# EAGLE design mother (EAGLE 8.2.2)

## Sheet 1 of 3
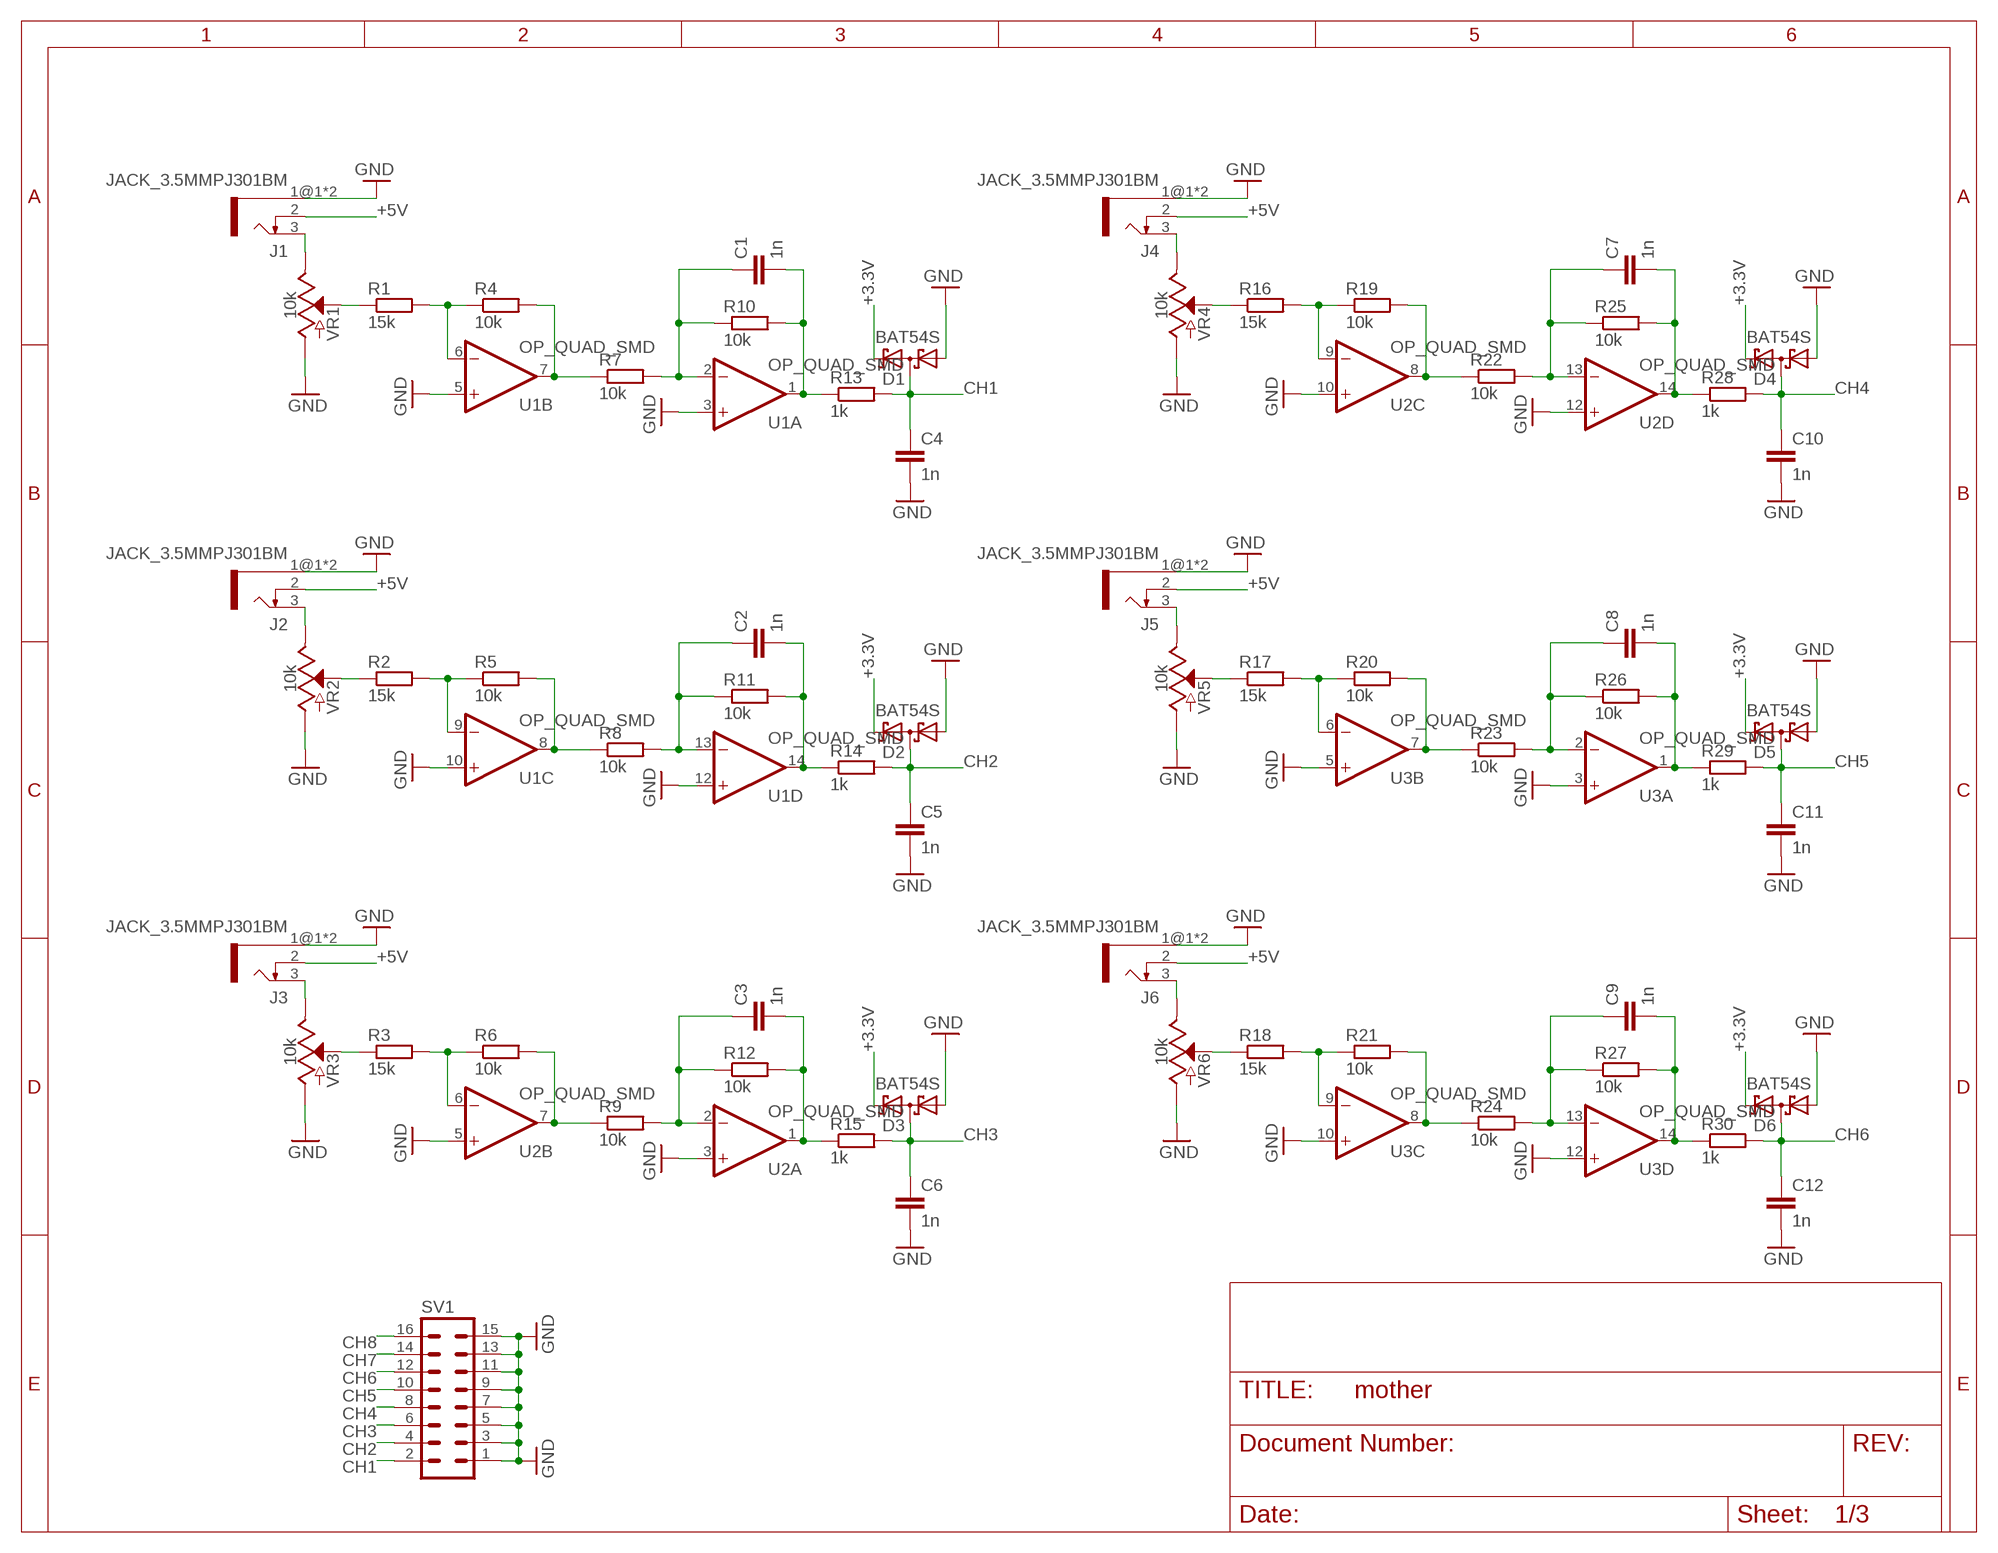
[diagram p0: schematic, sheet 1]

### Parts
C1  1n  CC0603  [C0603]
C2  1n  CC0603  [C0603]
C3  1n  CC0603  [C0603]
C4  1n  CC0603  [C0603]
C5  1n  CC0603  [C0603]
C6  1n  CC0603  [C0603]
C7  1n  CC0603  [C0603]
C8  1n  CC0603  [C0603]
C9  1n  CC0603  [C0603]
C10  1n  CC0603  [C0603]
C11  1n  CC0603  [C0603]
C12  1n  CC0603  [C0603]
D1  BAT54S  [SOT23]
D2  BAT54S  [SOT23]
D3  BAT54S  [SOT23]
D4  BAT54S  [SOT23]
D5  BAT54S  [SOT23]
D6  BAT54S  [SOT23]
J1  JACK_3.5MMPJ301BM  [PJ301BM_JACK]
J2  JACK_3.5MMPJ301BM  [PJ301BM_JACK]
J3  JACK_3.5MMPJ301BM  [PJ301BM_JACK]
J4  JACK_3.5MMPJ301BM  [PJ301BM_JACK]
J5  JACK_3.5MMPJ301BM  [PJ301BM_JACK]
J6  JACK_3.5MMPJ301BM  [PJ301BM_JACK]
R1  15k  RR0603  [R0603]
R2  15k  RR0603  [R0603]
R3  15k  RR0603  [R0603]
R4  10k  RR0603  [R0603]
R5  10k  RR0603  [R0603]
R6  10k  RR0603  [R0603]
R7  10k  RR0603  [R0603]
R8  10k  RR0603  [R0603]
R9  10k  RR0603  [R0603]
R10  10k  RR0603  [R0603]
R11  10k  RR0603  [R0603]
R12  10k  RR0603  [R0603]
R13  1k  RR0603  [R0603]
R14  1k  RR0603  [R0603]
R15  1k  RR0603  [R0603]
R16  15k  RR0603  [R0603]
R17  15k  RR0603  [R0603]
R18  15k  RR0603  [R0603]
R19  10k  RR0603  [R0603]
R20  10k  RR0603  [R0603]
R21  10k  RR0603  [R0603]
R22  10k  RR0603  [R0603]
R23  10k  RR0603  [R0603]
R24  10k  RR0603  [R0603]
R25  10k  RR0603  [R0603]
R26  10k  RR0603  [R0603]
R27  10k  RR0603  [R0603]
R28  1k  RR0603  [R0603]
R29  1k  RR0603  [R0603]
R30  1k  RR0603  [R0603]
SV1  MA08-2  [MA08-2]
U1  OP_QUAD_SMD  [SO14]
U2  OP_QUAD_SMD  [SO14]
U3  OP_QUAD_SMD  [SO14]
VR1  10k  POTENTIOMETER-PTH-9MM-1/20W-20%-KIT  [POT-PTH-ALPS-KIT]
VR2  10k  POTENTIOMETER-PTH-9MM-1/20W-20%-KIT  [POT-PTH-ALPS-KIT]
VR3  10k  POTENTIOMETER-PTH-9MM-1/20W-20%-KIT  [POT-PTH-ALPS-KIT]
VR4  10k  POTENTIOMETER-PTH-9MM-1/20W-20%-KIT  [POT-PTH-ALPS-KIT]
VR5  10k  POTENTIOMETER-PTH-9MM-1/20W-20%-KIT  [POT-PTH-ALPS-KIT]
VR6  10k  POTENTIOMETER-PTH-9MM-1/20W-20%-KIT  [POT-PTH-ALPS-KIT]

### Nets
+3.3V [power]: D1.2(C2) D2.2(C2) D3.2(C2) D4.2(C2) D5.2(C2) D6.2(C2) ; also sheet 3
+5V: J1.2 J2.2 J3.2 J4.2 J5.2 J6.2 ; also sheet 2,3
CH1: C4.1 D1.3(C1A2) R13.2 SV1.2
CH2: C5.1 D2.3(C1A2) R14.2 SV1.4
CH3: C6.1 D3.3(C1A2) R15.2 SV1.6
CH4: C10.1 D4.3(C1A2) R28.2 SV1.8
CH5: C11.1 D5.3(C1A2) R29.2 SV1.10
CH6: C12.1 D6.3(C1A2) R30.2 SV1.12
CH7: SV1.14
CH8: SV1.16
GND [ground]: C4.2 C5.2 C6.2 C10.2 C11.2 C12.2 D1.1(A1) D2.1(A1) D3.1(A1) D4.1(A1) D5.1(A1) D6.1(A1) J1.1@1 J1.1@2 J2.1@1 J2.1@2 J3.1@1 J3.1@2 J4.1@1 J4.1@2 J5.1@1 J5.1@2 J6.1@1 J6.1@2 SV1.1 SV1.3 SV1.5 SV1.7 SV1.9 SV1.11 SV1.13 SV1.15 U1.3(A:+IN) U1.5(B:+IN) U1.10(C:+IN) U1.12(D:+IN) U2.3(A:+IN) U2.5(B:+IN) U2.10(C:+IN) U2.12(D:+IN) U3.3(A:+IN) U3.5(B:+IN) U3.10(C:+IN) U3.12(D:+IN) VR1.P$1(A) VR2.P$1(A) VR3.P$1(A) VR4.P$1(A) VR5.P$1(A) VR6.P$1(A) ; also sheet 2,3
N$1: R2.1 VR2.P$2(S)
N$2: J2.3 VR2.P$3(E)
N$3: R1.2 R4.1 U1.6(B:-IN)
N$4: R4.2 R7.1 U1.7(B:OUT)
N$5: C1.1 R7.2 R10.1 U1.2(A:-IN)
N$6: C1.2 R10.2 R13.1 U1.1(A:OUT)
N$7: R1.1 VR1.P$2(S)
N$8: R2.2 R5.1 U1.9(C:-IN)
N$9: R5.2 R8.1 U1.8(C:OUT)
N$10: J1.3 VR1.P$3(E)
N$11: C2.1 R8.2 R11.1 U1.13(D:-IN)
N$12: C2.2 R11.2 R14.1 U1.14(D:OUT)
N$19: R16.2 R19.1 U2.9(C:-IN)
N$20: R19.2 R22.1 U2.8(C:OUT)
N$21: C7.1 R22.2 R25.1 U2.13(D:-IN)
N$22: C7.2 R25.2 R28.1 U2.14(D:OUT)
N$23: R16.1 VR4.P$2(S)
N$24: J4.3 VR4.P$3(E)
N$25: R3.2 R6.1 U2.6(B:-IN)
N$26: R6.2 R9.1 U2.7(B:OUT)
N$27: C3.1 R9.2 R12.1 U2.2(A:-IN)
N$28: C3.2 R12.2 R15.1 U2.1(A:OUT)
N$31: R3.1 VR3.P$2(S)
N$32: J3.3 VR3.P$3(E)
N$33: R18.2 R21.1 U3.9(C:-IN)
N$34: R21.2 R24.1 U3.8(C:OUT)
N$35: C9.1 R24.2 R27.1 U3.13(D:-IN)
N$36: C9.2 R27.2 R30.1 U3.14(D:OUT)
N$37: R18.1 VR6.P$2(S)
N$38: J6.3 VR6.P$3(E)
N$39: R17.2 R20.1 U3.6(B:-IN)
N$40: R20.2 R23.1 U3.7(B:OUT)
N$41: C8.1 R23.2 R26.1 U3.2(A:-IN)
N$42: C8.2 R26.2 R29.1 U3.1(A:OUT)
N$43: R17.1 VR5.P$2(S)
N$44: J5.3 VR5.P$3(E)

## Sheet 2 of 3
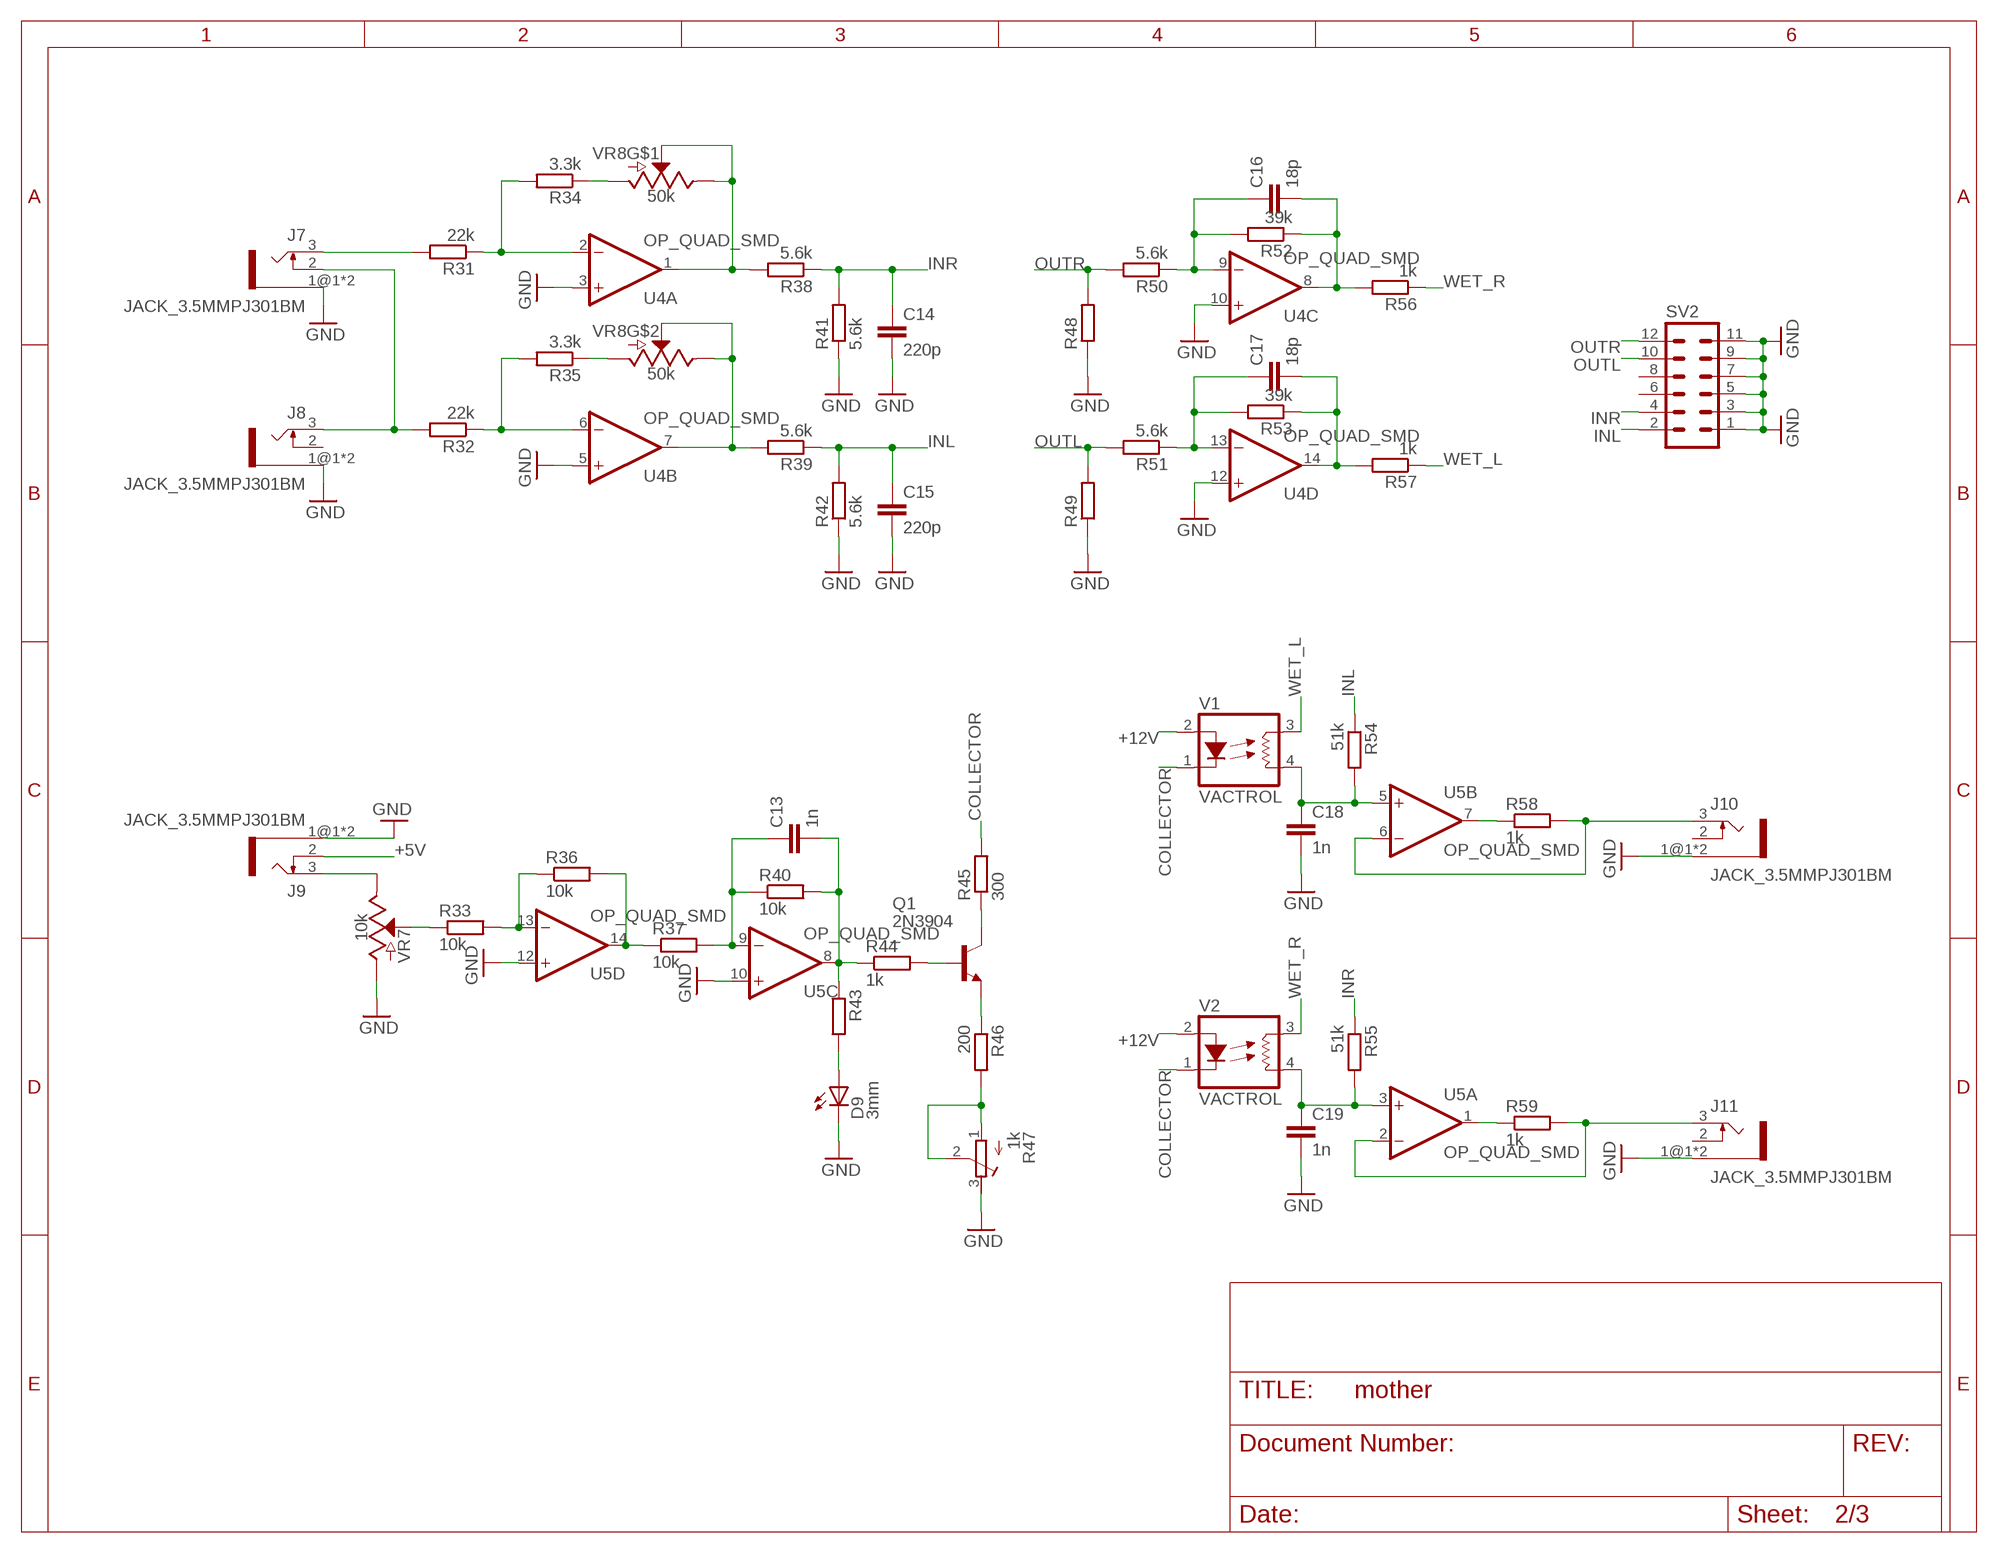
[diagram p1: schematic, sheet 2]

### Parts
C13  1n  CC0603  [C0603]
C14  220p  CC0603  [C0603]
C15  220p  CC0603  [C0603]
C16  18p  CC0603  [C0603]
C17  18p  CC0603  [C0603]
C18  1n  CC0603  [C0603]
C19  1n  CC0603  [C0603]
D9  3mm  LED3MM  [LED3MM]
J7  JACK_3.5MMPJ301BM  [PJ301BM_JACK]
J8  JACK_3.5MMPJ301BM  [PJ301BM_JACK]
J9  JACK_3.5MMPJ301BM  [PJ301BM_JACK]
J10  JACK_3.5MMPJ301BM  [PJ301BM_JACK]
J11  JACK_3.5MMPJ301BM  [PJ301BM_JACK]
Q1  2N3904  [TO92]
R31  22k  RR0603  [R0603]
R32  22k  RR0603  [R0603]
R33  10k  RR0603  [R0603]
R34  3.3k  RR0603  [R0603]
R35  3.3k  RR0603  [R0603]
R36  10k  RR0603  [R0603]
R37  10k  RR0603  [R0603]
R38  5.6k  RR0603  [R0603]
R39  5.6k  RR0603  [R0603]
R40  10k  RR0603  [R0603]
R41  5.6k  RR0603  [R0603]
R42  5.6k  RR0603  [R0603]
R43  RESISTOR10MM  [1/4W_RESISTOR]
R44  1k  RR0603  [R0603]
R45  300  RESISTOR10MM  [1/4W_RESISTOR]
R46  200  RR0603  [R0603]
R47  1k  R-TRIMM64W  [RTRIM64W]
R48  RR0603  [R0603]
R49  RR0603  [R0603]
R50  5.6k  RR0603  [R0603]
R51  5.6k  RR0603  [R0603]
R52  39k  RR0603  [R0603]
R53  39k  RR0603  [R0603]
R54  51k  RR0603  [R0603]
R55  51k  RR0603  [R0603]
R56  1k  RR0603  [R0603]
R57  1k  RR0603  [R0603]
R58  1k  RR0603  [R0603]
R59  1k  RR0603  [R0603]
SV2  MA06-2  [MA06-2]
U4  OP_QUAD_SMD  [SO14]
U5  OP_QUAD_SMD  [SO14]
V1  VACTROL  [VACTROL_4PIN_VTL5C]
V2  VACTROL  [VACTROL_4PIN_VTL5C]
VR7  10k  POTENTIOMETER-PTH-9MM-1/20W-20%-KIT  [POT-PTH-ALPS-KIT]
VR8  50k  POTENTIOMETER_DUAL-PTH-12MM-1/20W-20%-KIT  [POT-DUAL-PTH-PANASONIC-VERT-KIT]

### Nets
+5V: J9.2 ; also sheet 1,3
+12V [power]: V1.2(LED+) V2.2(LED+) ; also sheet 3
COLLECTOR: R45.2 V1.1(LED-) V2.1(LED-)
GND [ground]: C14.2 C15.2 C18.2 C19.2 D9.K(C) J7.1@1 J7.1@2 J8.1@1 J8.1@2 J9.1@1 J9.1@2 J10.1@1 J10.1@2 J11.1@1 J11.1@2 R41.1 R42.1 R47.3(A) R48.1 R49.1 SV2.1 SV2.3 SV2.5 SV2.7 SV2.9 SV2.11 U4.3(A:+IN) U4.5(B:+IN) U4.10(C:+IN) U4.12(D:+IN) U5.10(C:+IN) U5.12(D:+IN) VR7.P$1(A) ; also sheet 1,3
INL: C15.1 R39.1 R42.2 R54.1 SV2.2
INR: C14.1 R38.1 R41.2 R55.1 SV2.4
N$13: J9.3 VR7.P$3(E)
N$14: C13.2 R40.2 R43.1 R44.1 U5.8(C:OUT)
N$15: R33.1 VR7.P$2(S)
N$16: R33.2 R36.1 U5.13(D:-IN)
N$17: R36.2 R37.1 U5.14(D:OUT)
N$18: C13.1 R37.2 R40.1 U5.9(C:-IN)
N$29: D9.A R43.2
N$30: J10.3 R58.2 U5.6(B:-IN)
N$45: R58.1 U5.7(B:OUT)
N$46: C18.1 R54.2 U5.5(B:+IN) V1.4(RES2)
N$47: Q1.3(E) R46.1
N$48: R46.2 R47.1(E) R47.2(S)
N$49: Q1.1(C) R45.1
N$51: R34.1 VR8.A1(A)
N$52: Q1.2(B) R44.2
N$53: J11.3 R59.2 U5.2(A:-IN)
N$54: R59.1 U5.1(A:OUT)
N$55: C19.1 R55.2 U5.3(A:+IN) V2.4(RES2)
N$56: R35.1 VR8.B1(A)
N$61 [ground]: J7.2 J8.3 R32.2
N$62: J7.3 R31.2
N$69: C17.1 R51.1 R53.2 U4.13(D:-IN)
N$70: C17.2 R53.1 R57.2 U4.14(D:OUT)
N$72: C16.1 R50.1 R52.2 U4.9(C:-IN)
N$73: C16.2 R52.1 R56.2 U4.8(C:OUT)
N$74: R38.2 U4.1(A:OUT) VR8.A2(S) VR8.A3(E)
N$75: R39.2 U4.7(B:OUT) VR8.B2(S) VR8.B3(E)
N$78: R31.1 R34.2 U4.2(A:-IN)
N$79: R32.1 R35.2 U4.6(B:-IN)
OUTL: R49.2 R51.2 SV2.10
OUTR: R48.2 R50.2 SV2.12
WET_L: R57.1 V1.3(RES1)
WET_R: R56.1 V2.3(RES1)
Unconnected: J8.2 J10.2 J11.2 SV2.6 SV2.8

## Sheet 3 of 3
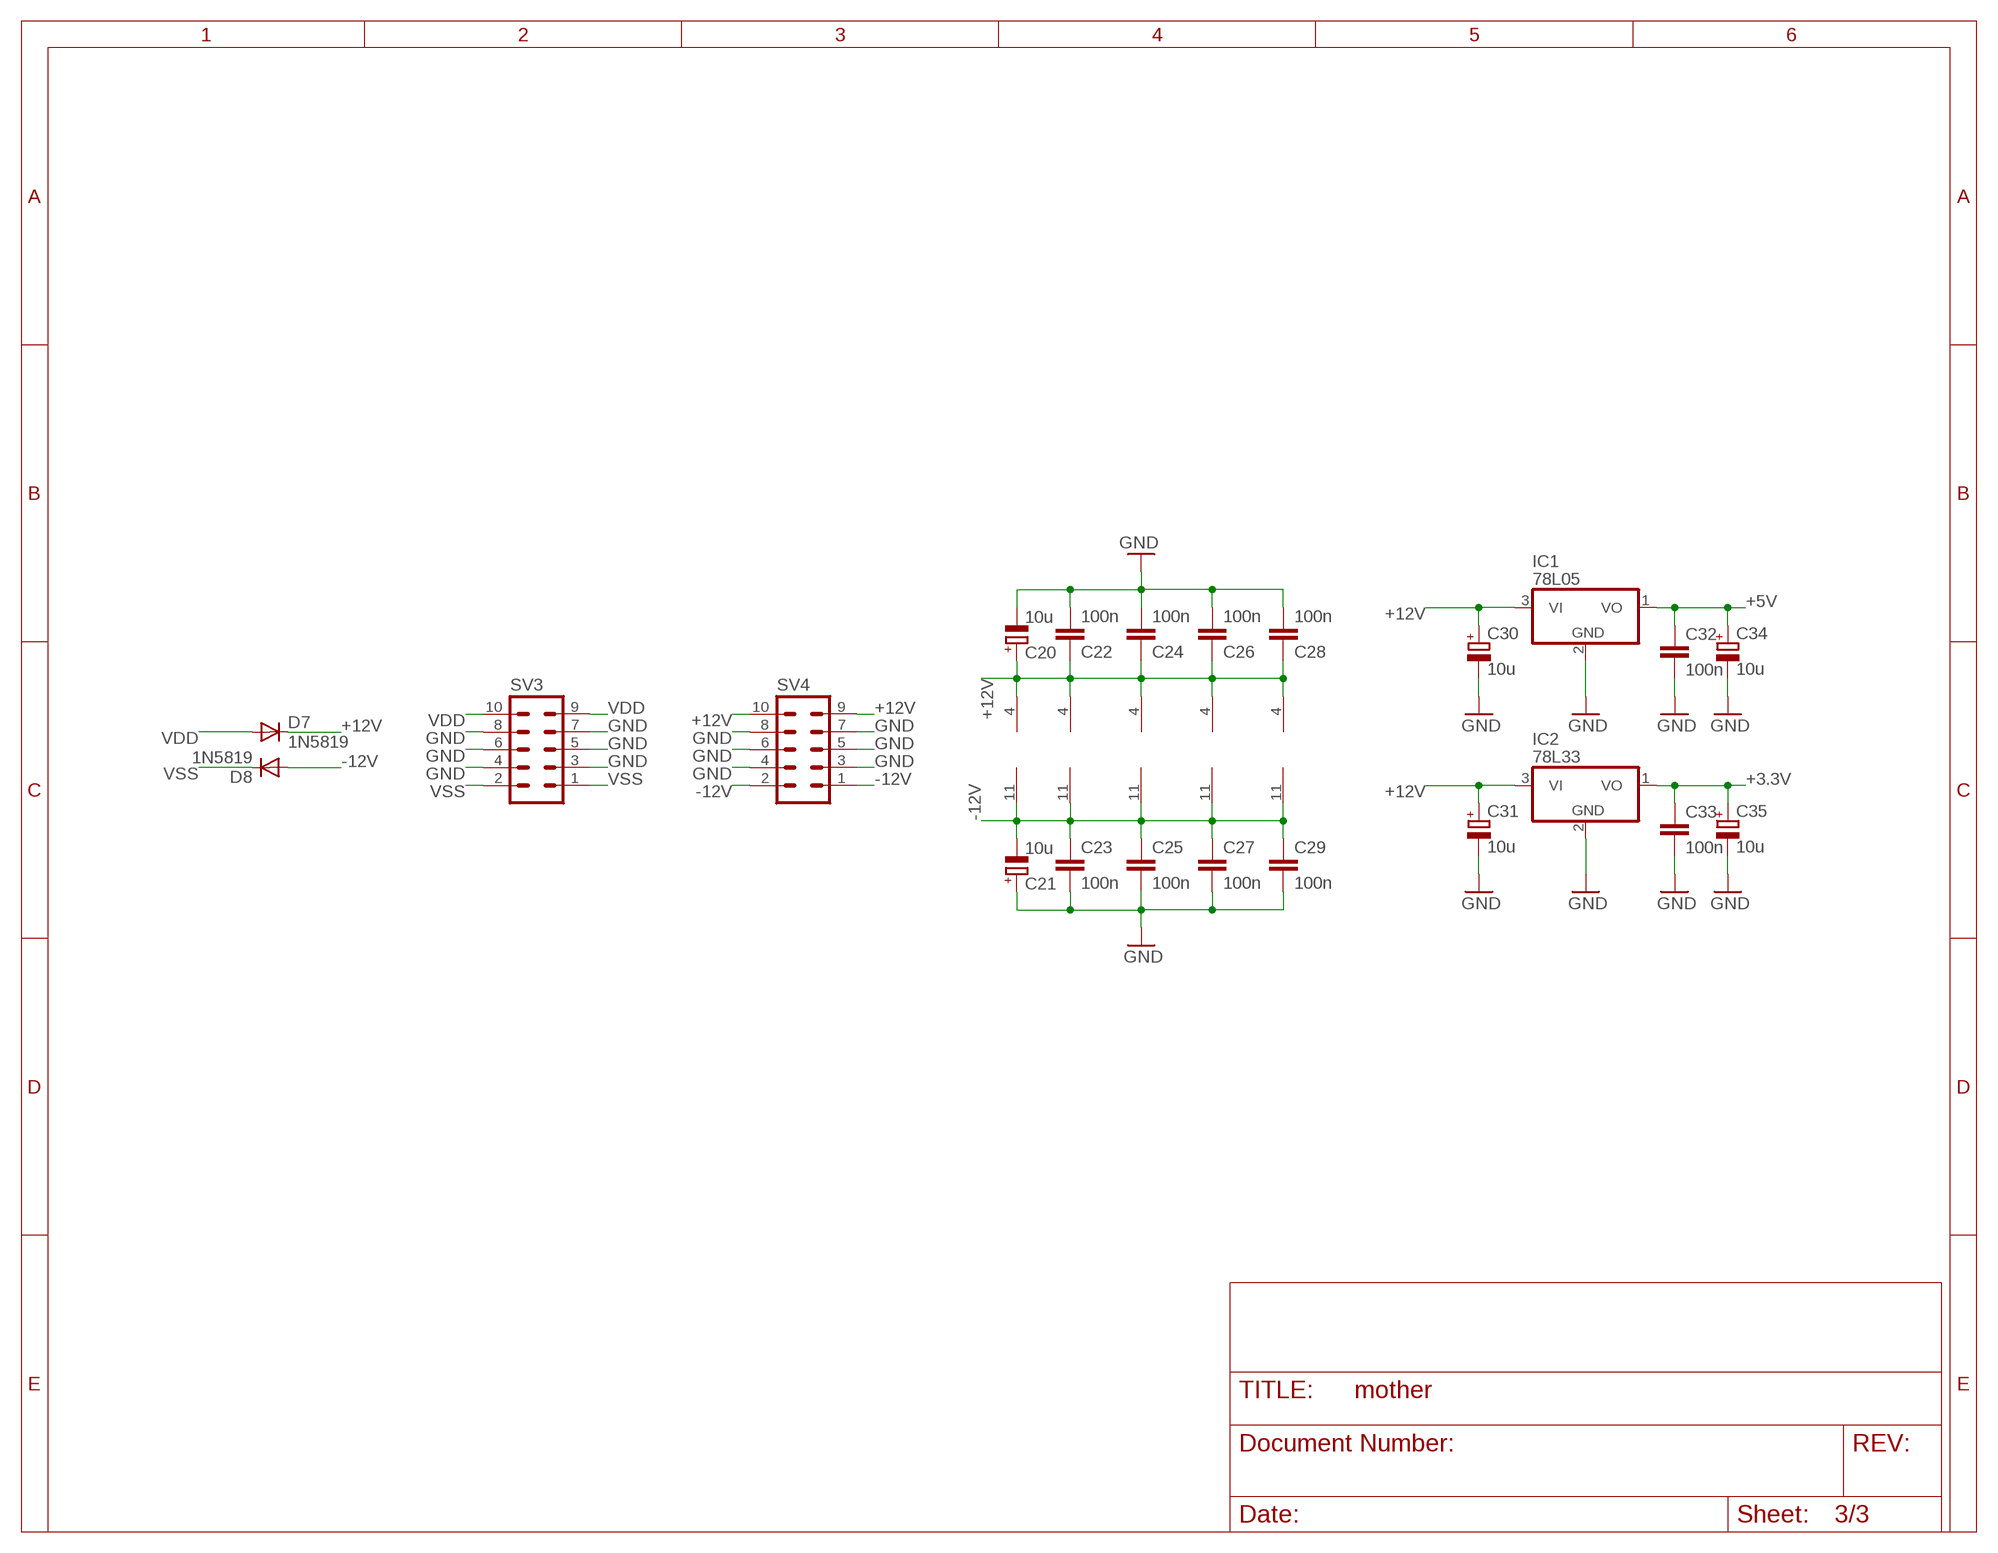
[diagram p2: schematic, sheet 3]

### Parts
C20  10u  CPOL-EUE2.5-6  [E2,5-6]
C21  10u  CPOL-EUE2.5-6  [E2,5-6]
C22  100n  C5/3.5  [C5B3.5]
C23  100n  C5/3.5  [C5B3.5]
C24  100n  C5/3.5  [C5B3.5]
C25  100n  C5/3.5  [C5B3.5]
C26  100n  C5/3.5  [C5B3.5]
C27  100n  C5/3.5  [C5B3.5]
C28  100n  C5/3.5  [C5B3.5]
C29  100n  C5/3.5  [C5B3.5]
C30  10u  CPOL-EUE2.5-6  [E2,5-6]
C31  10u  CPOL-EUE2.5-6  [E2,5-6]
C32  100n  C5/3.5  [C5B3.5]
C33  100n  C5/3.5  [C5B3.5]
C34  10u  CPOL-EUE2.5-6  [E2,5-6]
C35  10u  CPOL-EUE2.5-6  [E2,5-6]
D7  1N5819  CGRM4001-G  [SOD-123_MINI-SMA]
D8  1N5819  CGRM4001-G  [SOD-123_MINI-SMA]
IC1  78L05  78L05Z  [TO92]
IC2  78L33  78L05Z  [TO92]
SV3  MA05-2  [MA05-2]
SV4  MA05-2  [MA05-2]

### Nets
+3.3V [power]: C33.1 C35.+ IC2.1(VO) ; also sheet 1
+5V: C32.1 C34.+ IC1.1(VO) ; also sheet 1,2
+12V [power]: C20.+ C22.1 C24.1 C26.1 C28.1 C30.+ C31.+ D7.C IC1.3(VI) IC2.3(VI) SV4.9 SV4.10 U1.4(P:V+) U2.4(P:V+) U3.4(P:V+) U4.4(P:V+) U5.4(P:V+) ; also sheet 2
-12V: C21.- C23.1 C25.1 C27.1 C29.1 D8.A SV4.1 SV4.2 U1.11(P:V-) U2.11(P:V-) U3.11(P:V-) U4.11(P:V-) U5.11(P:V-)
GND [ground]: C20.- C21.+ C22.2 C23.2 C24.2 C25.2 C26.2 C27.2 C28.2 C29.2 C30.- C31.- C32.2 C33.2 C34.- C35.- IC1.2(GND) IC2.2(GND) SV3.3 SV3.4 SV3.5 SV3.6 SV3.7 SV3.8 SV4.3 SV4.4 SV4.5 SV4.6 SV4.7 SV4.8 ; also sheet 1,2
VDD [power]: D7.A SV3.9 SV3.10
VSS [power]: D8.C SV3.1 SV3.2

## Library data of the parts
C1-C19 = eagle-ltspice:C: CAPACITOR, European symbol; SPICEMODEL: NONE; SPICEPREFIX: C
C20 C21 C30 C31 C34 C35 = rcl:CPOL-EU: POLARIZED CAPACITOR, European symbol
C22-C29 C32 C33 = capacitor-wima:C: CAPACITOR naming: grid - package width
D1-D6 = diode:BAT54S: Schottky Diodes Pin connection corrected 2011-05-04 Source: Fairchild .. BAT54.pdf
D7 D8 = diode:CGRM400*-G: Molded plasitc,JEDEC SOD-123/Mini SMA Source: Comchip CGRM4001-G.pdf
D9 = led:LED: LED OSRAM: - CHIPLED LG R971, LG N971, LY N971, LG Q971, LY Q971, LO R971, LY R971 LH N974, LH R974 LS Q976, LO Q976, LY Q976 LO Q996 - Hyper CHIPLED LW Q18S LB Q993, LB Q99A, LB R99A - SideLED LS A670, LO A670, LY A670, LG A670, LP A670 LB A673, LV A673, LT A673, LW A673 LH A674 LY A675 LS A676, LA A676, LO A676, LY A676, LW A676 LS A679, LY A679, LG A679 - Hyper Micro SIDELED® LS Y876, LA Y876, LO Y876, LY Y876 LT Y87S - SmartLED LW L88C, LW L88S LB L89C, LB L89S, LG L890 LS L89K, LO L89K, LY L89K LS L896, LA L896, LO L896, LY L896 - TOPLED LS T670, LO T670, LY T670, LG T670, LP T670 LSG T670, LSP T670, LSY T670, LOP T670, LYG T670 LG T671, LOG T671, LSG T671 LB T673, LV T673, LT T673, LW T673 LH T674 LS T676, LA T676, LO T676, LY T676, LB T676, LH T676, LSB T676, LW T676 LB T67C, LV T67C, LT T67C, LS T67K, LO T67K, LY T67K, LW E67C LS E67B, LA E67B, LO E67B, LY E67B, LB E67C, LV E67C, LT E67C LW T67C LS T679, LY T679, LG T679 LS T770, LO T770, LY T770, LG T770, LP T770 LB T773, LV T773, LT T773, LW T773 LH T774 LS E675, LA E675, LY E675, LS T675 LS T776, LA T776, LO T776, LY T776, LB T776 LHGB T686 LT T68C, LB T68C - Hyper Mini TOPLED® LB M676 - Mini TOPLED Santana® LG M470 LS M47K, LO M47K, LY M47K Source: http://www.osram.convergy.de LUXEON: - LUMILED® LXK2-PW12-R00, LXK2-PW12-S00, LXK2-PW14-U00, LXK2-PW14-V00 LXK2-PM12-R00, LXK2-PM12-S00, LXK2-PM14-U00 LXK2-PE12-Q00, LXK2-PE12-R00, LXK2-PE12-S00, LXK2-PE14-T00, LXK2-PE14-U00 LXK2-PB12-K00, LXK2-PB12-L00, LXK2-PB12-M00, LXK2-PB14-N00, LXK2-PB14-P00, LXK2-PB14-Q00 LXK2-PR12-L00, LXK2-PR12-M00, LXK2-PR14-Q00, LXK2-PR14-R00 LXK2-PD12-Q00, LXK2-PD12-R00, LXK2-PD12-S00 LXK2-PH12-R00, LXK2-PH12-S00 LXK2-PL12-P00, LXK2-PL12-Q00, LXK2-PL12-R00 Source: www.luxeon.com KINGBRIGHT: KA-3528ASYC Source: www.kingbright.com
IC1 IC2 = linear:78*: Positive VOLTAGE REGULATOR Source: http://cache.national.com/ds/LM/LM78L05.pdf http://www.fairchildsemi.com/ds/LM/LM7805.pdf
J1-J11 = kweiwen:JACK_3.5MM
Q1 = transistor:2N3904: NPN TRANSISTOR
R1-R42 R44 R46 R48-R59 = eagle-ltspice:R: RESISTOR, European symbol; SPICEMODEL: NONE; SPICEPREFIX: R
R43 R45 = kweiwen:*RESISTOR*: Standard resistor, various versions
R47 = RepRapjr:R-TRIMM: Trimm resistor
SV1 = con-lstb:MA08-2: PIN HEADER; OC_FARNELL: unknown; OC_NEWARK: unknown
SV2 = con-lstb:MA06-2: PIN HEADER; OC_FARNELL: unknown; OC_NEWARK: unknown
SV3 SV4 = con-lstb:MA05-2: PIN HEADER; OC_FARNELL: unknown; OC_NEWARK: unknown
U1-U5 = kweiwen:OP_QUAD: Generic Quad Op Amp
V1 V2 = kweiwen:VACTROL: 4 Pin Vactrol Resistive Photocoupler
VR1-VR7 = kweiwen:POTENTIOMETER: Potentiometer (Pot) Three-terminal potentiometers, with an adjustable wiper and two adjustable resistors. A pot can be used to create a configurable voltage divider, or as a variable resistor. Variants ALPS_POT and ALPS_POT_KIT - PTH, breadboard compatible, 9mm square pots Rotary Potentiometer - Linear (10k ohm) <https://www.sparkfun.com/products/9288> (COM-09288) The KIT variant exposes copper on only one side of the PTH pad, so the part can only be assembled on one side of the PCB. Useful for beginner soldering kits.; PROD_ID: RES-09177; SF_SKU: COM-09288
VR8 = kweiwen:POTENTIOMETER_DUAL: Potentiometer (Pot) Dual-Gang Three-terminal potentiometers, with an adjustable wiper and two adjustable resistors. A pot can be used to create a configurable voltage divider, or as a variable resistor. This is a dua-gang pot - it includes two separate circuits, both controlled by one wiper. Variants PTH-12MM and PTH-12MM-KIT - 12mm Square, PTH Vertical Pots Used on the SparkFun SparkPunk Sound Kit <https://www.sparkfun.com/products/11177> (filter control) The KIT variant exposes copper on only one side of the PTH pad, so the part can only be assembled on one side of the PCB. Useful for beginner soldering kits.; PROD_ID: RES-11897

## Net classes
0 default: width 0.254 mm
1 power: width 0.305 mm
2 ground: width 0.406 mm

## Board
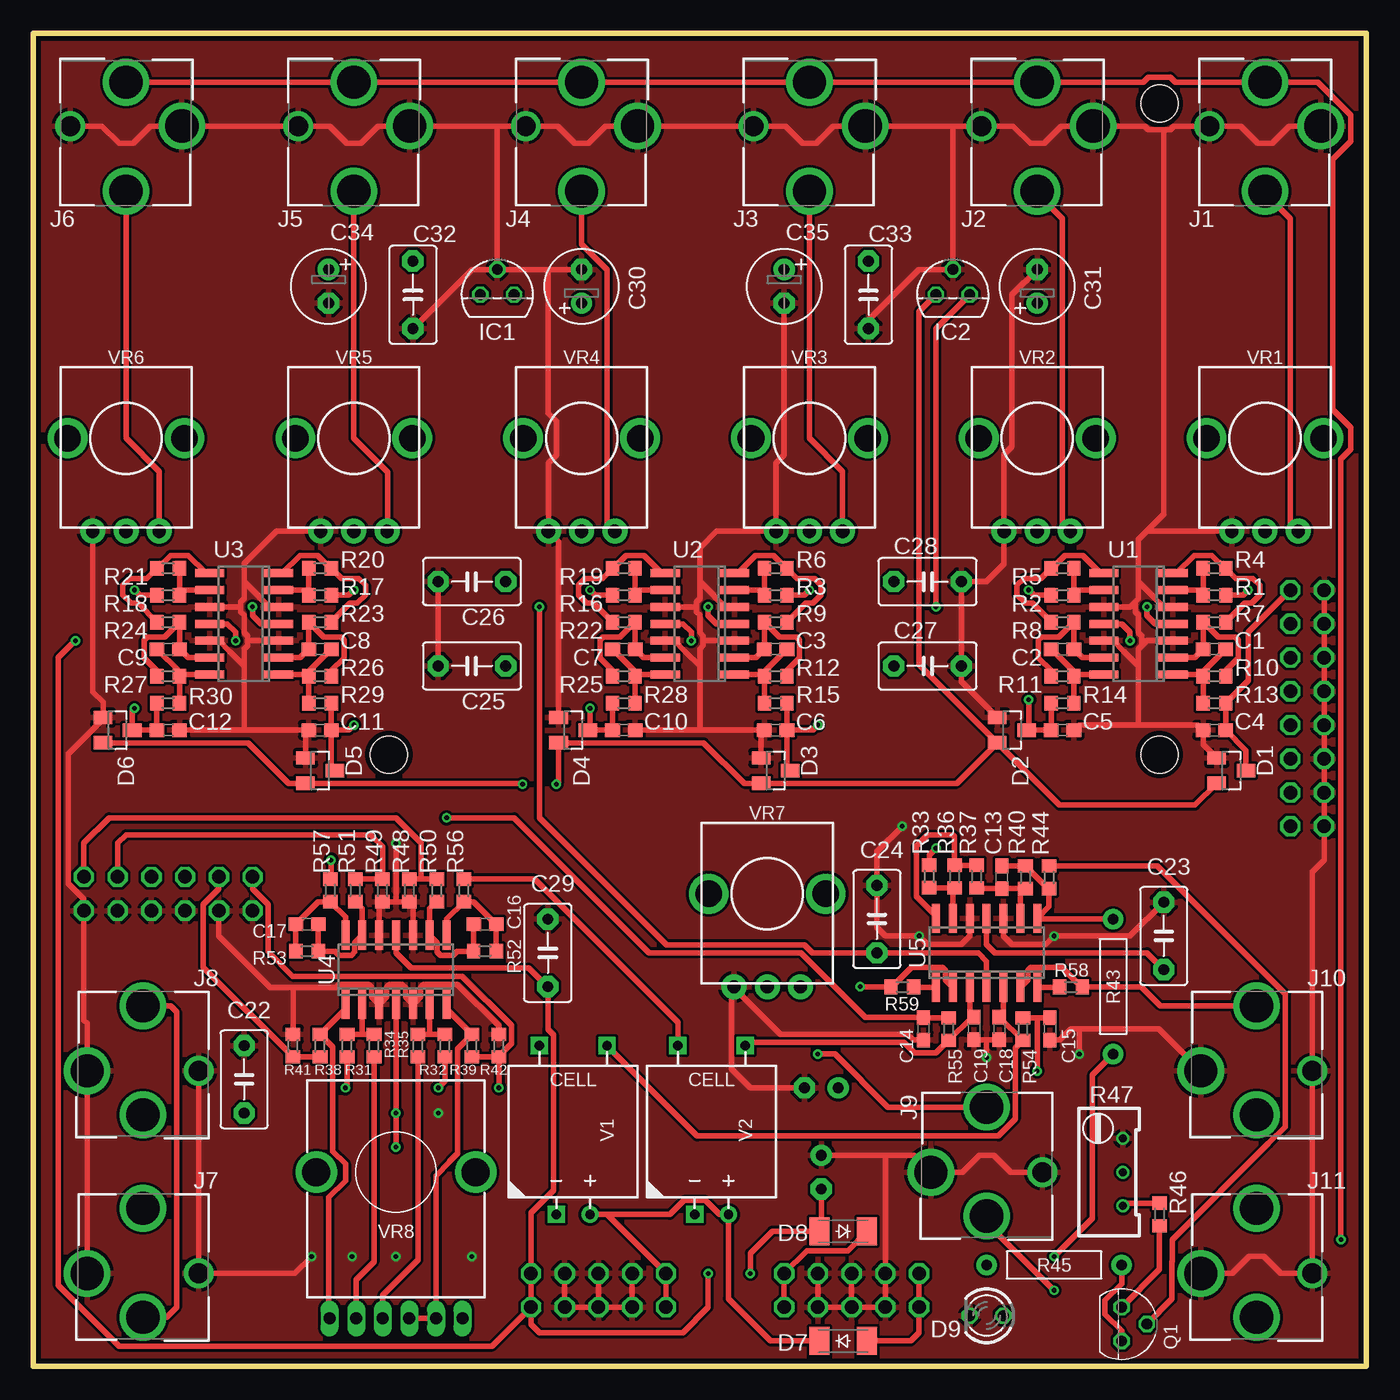
[diagram p3: board, top side]
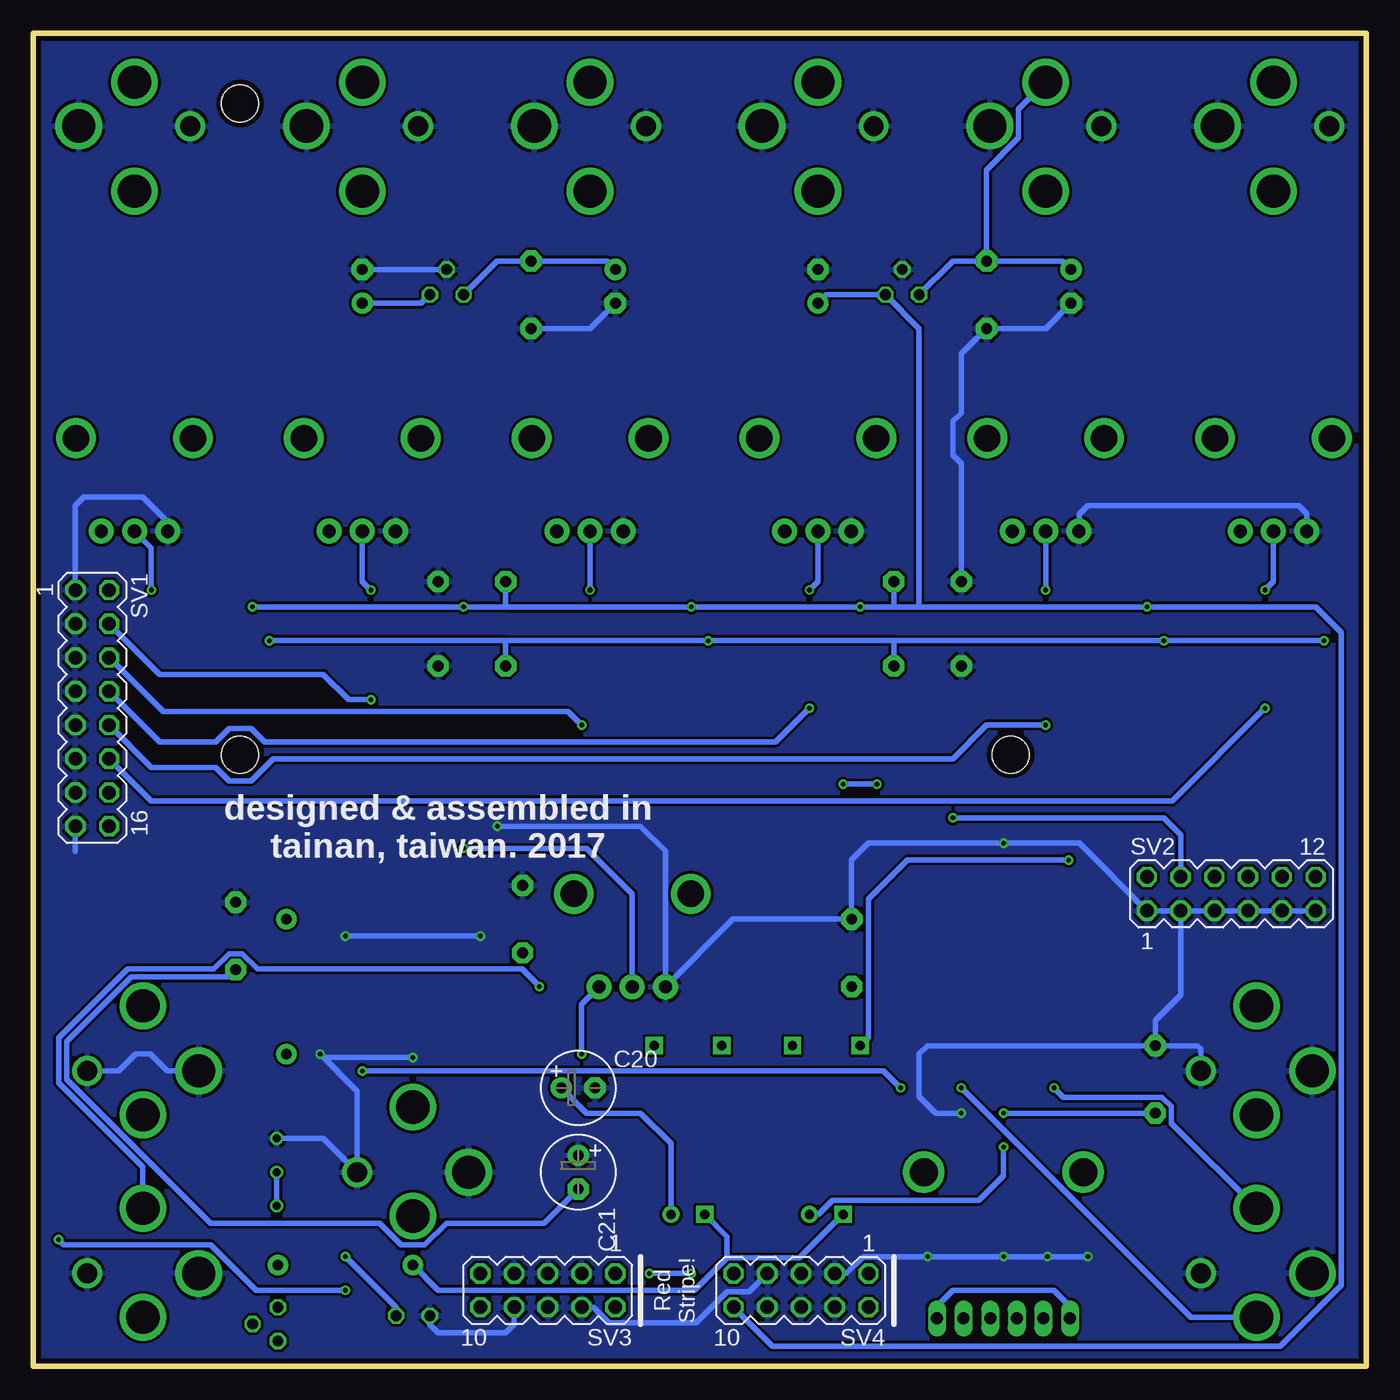
[diagram p4: board, bottom side, seen from below]

Size 100.33 x 100.33 mm. Coordinates in mm from the lower left corner, seen from the top.
Outline: 100.33,0 100.33,100.33 0,100.33 0,0 100.33,0
Copper layers (1*16): Top 0.0356mm / dielectric 1.5011mm / Bottom 0.0356mm
Design rules "oshpark-2layer *": minimum track width 6mil, minimum drill 13mil, track to track 8mil, track to pad 8mil, pad to pad 8mil, via to via 8mil, smd to smd 8mil, copper to edge 15mil, drill to drill 6mil, minimum pad ring 7mil, minimum via ring 7mil, stop-mask expansion 2.5mil, vias tented up to drill 20mil, thermal gap 10mil
Holes 2.79 mm at 26.76,46.04 84.76,46.04 84.76,95.05

### Footprints (pad centres in the part's own frame; a part is rotated, then mirrored left to right if it is on the bottom)
C0603 = smd 1.1 x 1: 1 -0.85,0; 2 0.85,0
E2,5-6 = drill 0.813 pad 1.6: + -1.27,0 | drill 0.813 pad 1.6 octagon: - 1.27,0
C5B3.5 = drill 0.813 pad 1.6 octagon: 1 -2.54,0; 2 2.54,0
SOT23 = smd 1 x 1.4: 1 -0.95,-1.1; 2 0.95,-1.1; 3 0,1.1
SOD-123_MINI-SMA = smd 1.5 x 2.1: A 1.8,0; C -1.8,0
LED3MM = drill 0.813 octagon: A -1.27,0; K 1.27,0
TO92 = drill 0.813 octagon: 1 -1.27,0; 2 0,1.905; 3 1.27,0
PJ301BM_JACK = drill 2.5: 1@1 -4.2,0; 2 0,-3.3; 3 0,4.9 | drill 1.5: 1@2 4.2,0
TO92' = drill 0.813 octagon: 1 1.27,0; 2 0,1.905; 3 -1.27,0
R0603 = smd 1 x 1.1: 1 -0.85,0; 2 0.85,0
1/4W_RESISTOR = drill 0.813 pad 1.524: 1 -5.08,0; 2 5.08,0
RTRIM64W = drill 0.61: 1 1.27,-2.54; 2 1.27,0; 3 1.27,2.54
MA08-2 = drill 1.016 octagon: 1 -8.89,-1.27; 2 -8.89,1.27; 3 -6.35,-1.27; 4 -6.35,1.27; 5 -3.81,-1.27; 6 -3.81,1.27; 7 -1.27,-1.27; 8 -1.27,1.27; 9 1.27,-1.27; 10 1.27,1.27; 11 3.81,-1.27; 12 3.81,1.27; 13 6.35,-1.27; 14 6.35,1.27; 15 8.89,-1.27; 16 8.89,1.27
MA06-2 = drill 1.016 octagon: 1 -6.35,-1.27; 2 -6.35,1.27; 3 -3.81,-1.27; 4 -3.81,1.27; 5 -1.27,-1.27; 6 -1.27,1.27; 7 1.27,-1.27; 8 1.27,1.27; 9 3.81,-1.27; 10 3.81,1.27; 11 6.35,-1.27; 12 6.35,1.27
MA05-2 = drill 1.016 octagon: 1 -5.08,-1.27; 2 -5.08,1.27; 3 -2.54,-1.27; 4 -2.54,1.27; 5 0,-1.27; 6 0,1.27; 7 2.54,-1.27; 8 2.54,1.27; 9 5.08,-1.27; 10 5.08,1.27
SO14 = smd 0.6 x 2.2: 1 -3.81,-2.6; 2 -2.54,-2.6; 3 -1.27,-2.6; 4 0,-2.6; 5 1.27,-2.6; 6 2.54,-2.6; 7 3.81,-2.6; 8 3.81,2.6; 9 2.54,2.6; 10 1.27,2.6; 11 0,2.6; 12 -1.27,2.6; 13 -2.54,2.6; 14 -3.81,2.6
VACTROL_4PIN_VTL5C = drill 0.7 pad 1.3 square: 1 -1.27,-6.35; 3 -2.54,6.35; 4 2.54,6.35 | drill 0.7 pad 1.3: 2 1.27,-6.35
POT-PTH-ALPS-KIT = drill 1 pad 1.88: P$1 7,-2.5; P$2 7,0; P$3 7,2.5 | drill 2: P$4 0,-4.4; P$5 0,4.4
POT-DUAL-PTH-PANASONIC-VERT-KIT = drill 0.9 long: A1 11,-3; A2 11,-5; A3 11,5; B1 11,-1; B2 11,1; B3 11,3 | drill 2.1: P$4 0,-6; P$5 0,6

### Placement (x,y rotation side)
C1  88.9,53.98 0 top
C2  77.47,53.98 180 top
C3  55.88,53.98 0 top
C4  88.9,47.88 180 top
C5  77.47,47.88 0 top
C6  55.88,47.88 180 top
C7  44.45,53.98 180 top
C8  21.59,53.98 0 top
C9  10.16,53.98 180 top
C10  44.45,47.88 0 top
C11  21.59,47.88 180 top
C12  10.16,47.88 0 top
C13  72.9,36.8 90 top
C14  66.99,25.4 270 top
C15  76.52,25.4 270 top
C16  34,33.27 0 top
C17  20.61,33.27 180 top
C18  72.71,25.43 270 top
C19  70.8,25.43 270 top
C20  59.31,20.96 0 bottom
C21  59.31,14.61 270 bottom
C22  15.88,21.59 90 top
C23  85.09,32.38 90 top
C24  63.5,33.66 90 top
C25  33.02,52.7 180 top
C26  33.02,59.05 180 top
C27  67.31,52.7 0 top
C28  67.31,59.05 0 top
C29  38.73,31.12 90 top
C30  41.27,81.28 90 top
C31  75.57,81.28 90 top
C32  28.58,80.65 270 top
C33  62.86,80.65 270 top
C34  22.23,81.28 270 top
C35  56.52,81.28 270 top
D1  90.17,44.83 270 top
D2  73.66,47.88 270 top
D3  55.88,44.83 270 top
D4  40.64,47.88 270 top
D5  21.59,44.83 270 top
D6  6.35,47.88 270 top
D7  60.96,1.91 0 top
D8  60.96,10.16 180 top
D9  71.76,3.81 180 top
IC1  34.92,80.65 0 top
IC2  69.22,80.65 0 top
J1  92.71,93.34 180 top
J2  75.57,93.34 180 top
J3  58.42,93.34 180 top
J4  41.27,93.34 180 top
J5  24.13,93.34 180 top
J6  6.98,93.34 180 top
J7  8.26,6.98 0 top
J8  8.26,22.23 0 top
J9  71.76,14.61 0 top
J10  92.08,22.23 0 top
J11  92.08,6.98 0 top
Q1  2N3904  [TO92']  81.92,3.17 270 top
R1  88.9,58.04 180 top
R2  77.47,58.04 0 top
R3  55.88,58.04 180 top
R4  88.9,60.07 0 top
R5  77.47,60.07 180 top
R6  55.88,60.07 0 top
R7  88.9,56.01 180 top
R8  77.47,56.01 0 top
R9  55.88,56.01 180 top
R10  88.9,51.94 180 top
R11  77.47,51.94 0 top
R12  55.88,51.94 180 top
R13  88.9,49.91 0 top
R14  77.47,49.91 180 top
R15  55.88,49.91 0 top
R16  44.45,58.04 0 top
R17  21.59,58.04 180 top
R18  10.16,58.04 0 top
R19  44.45,60.07 180 top
R20  21.59,60.07 0 top
R21  10.16,60.07 180 top
R22  44.45,56.01 0 top
R23  21.59,56.01 180 top
R24  10.16,56.01 0 top
R25  44.45,51.94 0 top
R26  21.59,51.94 180 top
R27  10.16,51.94 0 top
R28  44.45,49.91 180 top
R29  21.59,49.91 0 top
R30  10.16,49.91 180 top
R31  23.62,24.13 270 top
R32  30.99,24.13 270 top
R33  67.44,36.87 270 top
R34  25.65,24.13 90 top
R35  28.96,24.13 90 top
R36  69.34,36.86 90 top
R37  70.99,36.86 270 top
R38  21.59,24.13 90 top
R39  33.02,24.13 90 top
R40  74.68,36.8 90 top
R41  19.56,24.13 270 top
R42  35.05,24.13 270 top
R43  81.28,28.58 270 top
R44  76.45,36.8 90 top
R45  76.84,7.62 180 top
R46  84.77,11.43 90 top
R47  80.73,14.61 0 top
R48  28.32,35.81 90 top
R49  26.29,35.81 90 top
R50  30.37,35.81 90 top
R51  24.24,35.81 90 top
R52  34,31.24 180 top
R53  20.61,31.24 0 top
R54  74.49,25.37 270 top
R55  68.88,25.37 270 top
R56  32.41,35.81 270 top
R57  22.35,35.81 270 top
R58  78.11,28.55 0 top
R59  65.41,28.55 180 top
SV1  95.89,49.53 270 bottom
SV2  10.16,35.56 0 bottom
SV3  61.59,5.71 180 bottom
SV4  42.54,5.71 180 bottom
U1  83.19,55.88 90 top
U2  50.16,55.88 90 top
U3  15.88,55.88 90 top
U4  27.31,29.85 0 top
U5  71.76,31.12 0 top
V1  40.64,17.78 0 top
V2  51.05,17.78 0 top
VR1  92.71,69.85 270 top
VR2  75.57,69.85 270 top
VR3  58.42,69.85 270 top
VR4  41.27,69.85 270 top
VR5  24.13,69.85 270 top
VR6  6.98,69.85 270 top
VR7  55.24,35.56 270 top
VR8  27.31,14.61 270 top

### Tracks (layer width: path | path; a pad name or v marks a point on that pad's centre or on a via)
+3.3V  (via drill 0.35)
  Top 0.406: D6.2 16.18,46.93 19.22,43.88 D5.2 36.76,43.88 v36.83,43.81 | v39.37,43.81 39.54,43.98 D4.2 50.46,46.93 53.51,43.88 D3.2 69.51,43.88 D2.2 | IC2.1 66.68,79.38 66.68,52.81 D2.2 | D2.2 77.25,42.24 87.43,42.24 D1.2
  Bottom 0.406: v39.37,43.81 v36.83,43.81 | C35.+ 57.15,83.19 C33.1 65.41,83.19 IC2.1
+5V  (via drill 0.35)
  Top 0.406: J6.2 J5.2 J4.2 J3.2 J2.2 83.56,96.65 83.94,97.03 85.58,97.03 85.96,96.65 J1.2 96.67,96.65 99.17,94.14 99.17,92.19 97.82,90.84 97.82,72.02 99.17,70.66 99.17,69.04 98.43,68.29 v98.43,9.53 | J9.2 71.76,10.79 v76.84,5.71
  Bottom 0.406: C32.1 28.58,90.04 26.17,92.45 26.17,94.61 J5.2 | C32.1 31.12,83.19 IC1.1 | C32.1 22.86,83.19 C34.+ | v76.84,5.71 83.54,5.71 86.98,9.15 98.05,9.15 v98.43,9.53
+12V  (via drill 0.35)
  Top 0.406: SV4.10 SV4.9 43.18,11.43 V1.2 47.91,11.43 48.97,12.49 50.6,12.49 51.66,11.43 V2.2 52.32,5.08 55.5,1.91 D7.C | U4.4 v27.31,19.05 v27.31,16.51 | v83.82,57.15 83.82,56.52 84.45,55.88 U1.4 | v50.8,57.15 50.8,56.52 51.43,55.88 U2.4 | v16.51,57.15 16.51,56.52 17.15,55.88 U3.4 | v38.1,57.15 38.1,41.27 47.65,31.73 58.04,31.73 58.65,31.12 C24.1 71.12,31.12 71.76,30.48 U5.4 | v67.95,57.15 67.95,78.11 IC2.3
  Bottom 0.406: C22.1 v27.31,19.05 | 33.66,57.15 v16.51,57.15 3.81,57.15 1.89,55.23 1.89,6.09 6.46,1.52 44.7,1.52 SV4.10 | 33.66,57.15 35.56,57.15 | 35.56,57.15 v38.1,57.15 v50.8,57.15 64.77,57.15 | 64.77,57.15 v67.95,57.15 v83.82,57.15 | 64.77,57.15 C28.1 | 35.56,57.15 C26.1 | 33.66,57.15 33.66,78.11 IC1.3 40.64,80.65 C30.+ | C31.+ 71.12,80.01 IC2.3 | v27.31,16.51 27.31,14.35 29.17,12.49 40.19,12.49 41.24,11.43 V1.2 | V2.2 52.32,16.76 54.61,19.05 58.67,19.05 C20.+
-12V  (via drill 0.35)
  Top 0.406: SV4.2 SV4.1 37.46,11.56 39.16,13.25 39.16,24.95 38.73,25.37 C29.1 38.71,28.55 37.29,29.97 28.45,29.97 27.31,31.12 U4.11 | v82.55,54.61 82.55,55.24 81.92,55.88 U1.11 | v49.53,54.61 49.53,55.24 48.89,55.88 U2.11 | v15.24,54.61 15.24,55.24 14.61,55.88 U3.11 | U5.11 71.76,31.75 72.39,31.12 83.82,31.12 C23.1 | v3.17,54.61 1.89,53.33 1.89,6.09 6.46,1.52 34.54,1.52 SV4.2 | v50.8,6.98 50.8,4.45 48.89,2.54 38.1,2.54 37.46,3.17 SV4.2 | v53.98,6.98 53.98,8.51 55.63,10.16 D8.A 59.31,10.31 C21.-
  Bottom 0.406: 35.56,54.61 v15.24,54.61 v3.17,54.61 | 35.56,54.61 v49.53,54.61 64.77,54.61 | 64.77,54.61 v82.55,54.61 | C27.1 64.77,54.61 | C25.1 35.56,54.61 | v53.98,6.98 v50.8,6.98 | C23.1 85.65,29.29 92.97,29.29 97.81,24.46 97.81,21.59 86.98,10.76 74.27,10.76 72.65,9.14 70.86,9.14 69.23,10.77 61.87,10.77 C21.-
CH1
  Top 0.406: C4.1 R13.2 91.44,51.6 91.44,55.24 SV1.2 | C4.1 89.79,47.88 | C4.1 91.27,46.36 D1.3
CH2  (via drill 0.35)
  Top 0.406: R14.2 C5.1 D2.3 74.93,48.05 v74.93,50.16
  Bottom 0.406: v74.93,50.16 76.59,50.16 78.49,52.07 90.81,52.07 SV1.4
CH3  (via drill 0.35)
  Top 0.406: C6.1 R15.2 | C6.1 58.67,47.88 v59.05,48.26 | D3.3 56.73,44.83 C6.1
  Bottom 0.406: v59.05,48.26 60.08,49.28 90.56,49.28 SV1.6
CH4  (via drill 0.35)
  Top 0.406: R28.2 C10.1 D4.3 41.91,48.05 v41.91,49.53
  Bottom 0.406: SV1.8 90.81,46.99 86.61,46.99 85.58,48.02 83.94,48.02 82.91,46.99 44.45,46.99 v41.91,49.53
CH5  (via drill 0.35)
  Top 0.406: R29.2 C11.1 | C11.1 22.48,47.88 | C11.1 23.75,47.88 v24.13,48.26 | C11.1 22.44,45.08 D5.3
  Bottom 0.406: SV1.10 91.44,45.09 86.61,45.09 85.58,44.06 83.94,44.06 82.28,45.72 31.12,45.72 28.58,48.26 v24.13,48.26
CH6  (via drill 0.35)
  Top 0.406: R30.2 C12.1 D6.3 7.45,49.36 v7.62,49.53
  Bottom 0.406: v7.62,49.53 14.61,42.54 91.44,42.54 SV1.12
COLLECTOR
  Bottom 0.406: 48.11,8.15 50.55,5.71 69.85,5.71 R45.2 | 48.11,8.15 42.65,8.15 V1.1 | 48.11,8.15 48.11,9.75 V2.1
GND  (via drill 0.35)
  Top 0.406: R48.1 R49.1 26.04,34.71 U4.12 | R48.1 27.31,34.99 v27.31,39.37 | SV4.7 SV4.8 SV4.6 | SV4.5 SV4.6 | SV4.3 SV4.4 SV4.6 | J8.1@2 J7.1@2 19.69,6.98 v20.96,8.26 | SV3.3 SV3.4 SV3.6 | SV3.5 SV3.6 | SV3.6 SV3.8 SV3.7 64.14,15.79 64.22,15.88 | 19.69,28.51 22.79,28.51 23.03,28.75 25.23,28.75 25.47,28.51 25.47,27.81 U4.3 26.6,27.81 26.6,28.51 26.84,28.75 27.77,28.75 28.01,28.51 28.01,27.81 U4.5 29.14,27.81 29.14,28.51 29.38,28.75 31.92,28.75 35.05,25.62 R42.1 | 19.69,28.51 17.84,28.51 13.97,32.38 SV2.3 | J11.1@1 90.26,6.98 91.54,8.27 92.61,8.27 93.89,6.98 J11.1@2 J10.1@2 96.28,37.22 97.16,38.1 SV1.15 SV1.13 SV1.11 SV1.9 SV1.7 SV1.5 SV1.3 SV1.1 | J7.1@1 J8.1@1 4.05,25.79 3.81,26.04 SV2.11 3.81,35.18 2.64,36.35 2.64,46.09 5.25,48.7 D6.1 5.25,49.99 4.49,50.76 VR6.P$1 | U4.10 28.58,34.71 R48.1 | R41.1 19.56,28.39 19.69,28.51 | 15.88,47.88 C12.2 | 15.88,47.88 C11.2 20.49,47.63 D5.1 | 50.16,47.88 C10.2 | 50.16,47.88 C6.2 54.78,47.88 D3.1 | 50.16,52.7 50.16,47.88 | 15.88,52.7 15.88,47.88 | 69.22,93.34 J2.1@2 73.75,93.34 75.03,92.06 76.1,92.06 77.38,93.34 J2.1@1 83.66,93.34 83.94,93.07 85.09,93.07 | 69.22,93.34 J3.1@1 60.24,93.34 58.95,92.06 57.89,92.06 56.6,93.34 J3.1@2 J4.1@1 43.09,93.34 41.81,92.06 40.74,92.06 39.46,93.34 J4.1@2 34.92,93.34 | 34.92,93.34 J5.1@1 25.95,93.34 24.66,92.06 23.6,92.06 22.31,93.34 J5.1@2 J6.1@1 8.8,93.34 7.52,92.06 6.45,92.06 5.17,93.34 J6.1@2 | D4.1 39.54,62.09 VR4.P$1 38.77,67.98 39.37,68.58 39.37,71.12 38.73,71.76 38.73,82.42 38.61,82.55 | 97.21,93.05 J1.1@1 94.53,93.34 93.24,92.06 92.18,92.06 90.89,93.34 J1.1@2 85.86,93.34 85.58,93.07 85.09,93.07
  Top 0.406: C25.2 C26.2 | J9.1@2 73.57,14.61 72.29,15.89 71.22,15.89 69.94,14.61 J9.1@1 66.29,15.88 64.22,15.88 | C5.2 78.36,47.88 78.74,48.26 83.19,48.26 | 83.19,48.26 87.67,48.26 C4.2 | 15.88,52.7 15.88,53.99 16.12,54.24 16.12,54.61 | 16.12,54.61 16.12,54.98 15.88,55.23 15.88,56.53 15.63,56.78 15.63,57.15 | 15.63,57.15 15.63,57.52 15.88,57.77 15.88,59.05 | 50.16,59.05 50.16,57.77 49.92,57.52 49.92,57.15 | 49.92,57.15 49.92,56.78 50.16,56.53 50.16,55.23 50.41,54.98 50.41,54.61 | 50.41,54.61 50.41,54.24 50.16,53.99 50.16,52.7 | 73.07,62.27 VR2.P$1 | D2.1 69.85,51.54 C27.2 C28.2 71.76,59.05 73.07,60.36 VR2.P$1 | 34.92,93.34 IC1.2 | 69.22,82.59 69.22,93.34 | 69.22,82.59 IC2.2 | 87.8,47.63 C4.2 | 71.76,24.58 v71.76,23.24 | C14.2 66.23,24.55 65.79,24.99 56.24,24.99 52.7,28.52 VR7.P$1 52.54,28.35 52.54,24.77 | C19.2 71.76,24.58 | C18.2 71.76,24.58 | 15.88,59.05 15.88,60.41 18.32,62.85 VR5.P$1 | 83.19,59.05 83.19,57.77 82.94,57.52 | U5.12 70.48,32.38 69.85,31.75 67.31,31.75 v66.68,32.38 64.14,32.38 63.5,33.02 C24.2 63.5,38.73 v65.41,40.64 | U5.10 73.03,32.38 73.66,31.75 76.2,31.75 v76.84,32.38 82.55,32.38 C23.2 | 83.19,52.7 83.19,48.26 | 83.19,52.7 83.19,53.98 | 83.19,53.98 83.82,54.61 U1.3 | U1.10 82.57,57.15 82.94,57.52 | 83.19,53.98 83.17,53.98 | 83.19,53.98 83.19,53.99 83.43,54.24 83.43,54.98 83.19,55.23 83.19,56.53 82.94,56.78 82.94,57.52 | C4.2 88.05,46.8 D1.1 | U2.10 49.92,57.15 | U2.3 50.41,54.61 | 50.16,52.7 49.07,53.8 49.07,53.81 48.27,54.61 U2.12 | 50.16,59.05 51.26,57.96 51.26,57.95 52.06,57.15 U2.5 | 83.19,59.05 84.28,57.96 84.28,57.95 85.08,57.15 U1.5 | 83.19,52.7 82.09,53.8 82.09,53.81 81.29,54.61 U1.12
  Top 0.406: 15.88,59.05 16.97,57.96 16.97,57.95 17.77,57.15 U3.5 | U3.10 15.63,57.15 | U3.3 16.12,54.61 | 15.88,52.7 14.78,53.8 14.78,53.81 13.98,54.61 U3.12 | 38.61,82.55 IC1.2 | 38.61,82.55 C30.- | C15.2 77.26,24.55 78.11,25.4 78.74,25.4 | 78.74,25.4 84.7,25.4 J10.1@1 | 78.74,25.4 v78.74,23.5 | 83.19,59.05 83.19,62.23 83.82,62.86 | 83.82,62.86 90.2,62.86 VR1.P$1 | 50.16,59.05 50.16,61.59 51.42,62.85 VR3.P$1 55.92,67.98 56.52,68.58 C35.- | IC1.2 33.02,82.55 C32.2 | 85.09,93.07 85.09,64.14 83.82,62.86 | VR2.P$1 73.07,68.62 73.66,69.22 73.66,80.65 C31.- | C33.2 62.86,78.74 66.68,82.55 69.17,82.55 69.22,82.59 | 64.22,15.88 C21.+ | C20.- 53.98,20.96 52.54,22.39 52.54,24.77 | 52.54,24.95 52.54,24.77
  Bottom 0.406: J10.1@2 93.89,22.23 92.61,23.51 91.54,23.51 90.26,22.23 J10.1@1 | SV2.11 SV2.9 SV2.7 SV2.5 SV2.3 | SV2.3 SV2.1 21.59,39.37 v27.31,39.37 37.46,39.37 38.73,38.1 C29.2 47.65,33.66 VR7.P$1 52.74,34.76 52.75,34.77 52.75,38.78 54.61,40.64 v65.41,40.64 | SV3.4 58.17,4.45 57,3.28 50.45,3.28 48.11,5.61 46.46,5.61 SV4.7 | 97.16,38.73 SV1.15 | v66.68,32.38 v76.84,32.38 | SV4.3 39.12,6.98 37.85,8.26 v33.02,8.26 v27.31,8.26 v24,8.26 v20.96,8.26 | C34.- 24.13,78.11 C32.2 30.48,76.2 30.48,71.76 31.12,71.12 31.12,68.58 30.48,67.95 C26.2 | IC2.2 C31.- | C33.2 58.42,78.11 C35.- | SV2.3 13.97,27.94 15.88,26.04 C22.2 | J8.1@2 12.46,23.89 12.7,24.13 C22.2 | C22.2 33.02,24.13 33.66,23.5 33.66,20.32 32.38,19.05 v30.48,19.05 | SV3.8 64.14,3.17 64.77,2.54 69.85,2.54 70.48,3.17 D9.K | v71.76,23.24 78.49,23.24 v78.74,23.5 75.95,20.71 J9.1@2 78.5,17.15 R47.3 | VR1.P$1 90.21,63.54 92.08,65.41 96.52,65.41 97.16,64.77 SV1.1 | VR6.P$1 4.49,64.17 5.08,64.77 20.96,64.77 21.59,64.14 21.59,62.89 VR5.P$1
  pour Bottom: 0,0 100.33,0 100.33,100.33 0,100.33
  pour Top: 0,0 100.33,0 100.33,100.33 0,100.33
INL  (via drill 0.35)
  Top 0.406: SV2.2 16.51,35.94 17.68,34.77 17.68,31.22 19.53,29.36 32.3,29.36 36.01,25.65 36.01,24.31 35.05,23.36 R42.2 | R39.1 R42.2 | 74.51,26.25 R54.1 75.57,26.23 | R42.2 v35.05,20.96 | 75.57,26.23 76.49,26.23 C15.1 | 75.57,26.23 v75.57,22.23
  Bottom 0.406: v35.05,20.96 36.32,22.23 v75.57,22.23
INR  (via drill 0.35)
  Top 0.406: SV2.4 13.97,35.94 12.8,34.77 12.8,30.04 R41.2 R38.1 | R55.1 67.02,26.23 C14.1 62.65,26.25 57.78,31.12 46.35,31.12 36.2,41.27 v31.12,41.27
  Bottom 0.406: SV2.4 13.97,40 15.24,41.27 v31.12,41.27
N$1  (via drill 0.35)
  Top 0.406: R2.1 75.31,58.04 v74.93,58.42
  Bottom 0.406: VR2.P$2 75.57,59.05 v74.93,58.42
N$2
  Top 0.406: J2.3 75.57,88.27 77.47,86.36 77.47,63.45 VR2.P$3
N$3
  Top 0.406: 88.05,58.42 R1.2 | 88.05,58.42 R4.1 | U1.6 88.05,58.42
N$4
  Top 0.406: R7.1 91.17,57.43 91.7,57.43 92.32,58.05 92.32,58.79 91.81,59.3 90.52,59.3 R4.2 89.68,60.07 88.72,61.03 87.38,61.03 86.04,59.69 U1.7
N$5
  Top 0.406: U1.2 87.42,53.34 C1.1 | C1.1 88.05,53.64 | C1.1 R7.2 89.18,54.88 90.47,54.88 90.71,54.64 90.71,53.31 89.75,52.35 R10.1
N$6
  Top 0.406: R13.1 R10.2 | U1.1 87.92,52.07 R10.2 | R10.2 88.05,52.27 C1.2
N$7  (via drill 0.35)
  Top 0.406: R1.1 91.06,58.04 v91.44,58.42
  Bottom 0.406: v91.44,58.42 91.44,61.58 VR1.P$2
N$8
  Top 0.406: 78.32,58.42 R2.2 | 78.32,58.42 R5.1 | U1.9 78.32,58.42
N$9
  Top 0.406: R8.1 75.2,57.43 74.67,57.43 74.05,58.05 74.05,58.79 74.56,59.3 75.85,59.3 R5.2 76.7,60.07 77.65,61.03 78.99,61.03 80.33,59.69 U1.8
N$10
  Top 0.406: J1.3 92.71,88.27 94.62,86.36 94.62,63.45 VR1.P$3
N$11
  Top 0.406: R8.2 78.32,55.67 | U1.13 78.95,53.34 C2.1 78.32,55.24 R8.2 | R8.2 77.19,54.88 75.9,54.88 75.66,54.64 75.66,53.31 76.62,52.35 R11.1
N$12
  Top 0.406: R14.1 R11.2 | U1.14 78.45,52.07 R11.2 | R11.2 78.32,52.27 C2.2
N$13  (via drill 0.35)
  Top 0.406: J9.3 64.31,19.51 60.32,23.5 v59.05,23.5
  Bottom 0.406: 59.02,23.54 v59.05,23.5 59.05,27.25 VR7.P$3
N$14
  Top 0.406: 76.2,35.7 R44.1 | C13.2 R40.2 76.38,35.95 R44.1 | R44.1 76.45,34.6 U5.8 75.62,33.66 R43.1
N$15  (via drill 0.35)
  Top 0.406: 67.44,38.23 R33.1 67.44,38.48 v67.95,38.99
  Bottom 0.406: VR7.P$2 55.24,35.56 58.67,38.99 v67.95,38.99
N$16
  Top 0.406: R36.1 69.33,36.02 | R33.2 69.33,36.02 | 69.33,36.02 R36.1 | U5.13 69.22,35.88 R36.1
N$17
  Top 0.305: 67.95,33.88 U5.14
  Top 0.406: R36.2 69.07,37.7 | R36.2 69.34,39.88 69.22,40 67.31,40 66.48,39.18 66.48,35.35 67.95,33.88 U5.14 | R37.1 R36.2
N$18
  Top 0.406: C13.1 R40.1 74.3,35.57 U5.9 | C13.1 71.01,35.95 R37.2 | 73.03,35.83 C13.1
N$19
  Top 0.406: R19.1 R16.2 45.68,58.42 U2.9
N$20
  Top 0.406: R22.1 42.18,57.43 41.65,57.43 41.03,58.05 41.03,58.79 41.54,59.3 42.83,59.3 R19.2 43.67,60.07 44.63,61.03 45.97,61.03 47.31,59.69 U2.8
N$21
  Top 0.406: U2.13 45.93,53.34 C7.1 R22.2 44.17,54.88 42.88,54.88 42.64,54.64 42.64,53.31 43.6,52.35 R25.1
N$22
  Top 0.406: R28.1 R25.2 | R25.2 45.43,52.07 U2.14 | R25.2 45.3,52.27 C7.2
N$23  (via drill 0.35)
  Top 0.406: R16.1 42.29,58.04 v41.91,58.42
  Bottom 0.406: VR4.P$2 41.27,59.05 v41.91,58.42
N$24
  Top 0.406: J4.3 41.27,84.45 43.18,82.55 43.18,63.45 VR4.P$3
N$25
  Top 0.406: R6.1 R3.2 54.65,58.42 U2.6
N$26
  Top 0.406: R9.1 58.15,57.43 58.68,57.43 59.3,58.05 59.3,58.79 58.79,59.3 57.5,59.3 R6.2 56.66,60.07 55.7,61.03 54.36,61.03 53.02,59.69 U2.7
N$27
  Top 0.406: U2.2 54.39,53.34 C3.1 R9.2 56.16,54.88 57.45,54.88 57.69,54.64 57.69,53.31 56.73,52.35 R12.1
N$28
  Top 0.406: R15.1 R12.2 | R12.2 54.9,52.07 U2.1 | R12.2 55.03,52.27 C3.2
N$29  (via drill 0.35)
  Top 0.406: v76.84,8.26 79.72,11.14 79.72,21.93 R43.2
  Bottom 0.406: D9.A 73.03,4.45 v76.84,8.26
N$30
  Top 0.406: U5.6 74.86,29.08 74.86,29.78 75.1,30.02 77.41,30.02 78.88,28.55 R58.2 83.41,28.55 84.83,27.12 J10.3
N$31  (via drill 0.35)
  Top 0.406: R3.1 58.04,58.04 v58.42,58.42
  Bottom 0.406: VR3.P$2 v58.42,58.42
N$32
  Top 0.406: VR3.P$3 60.92,67.35 58.42,69.85 J3.3
N$33
  Top 0.406: 11.01,58.42 R18.2 | 11.01,58.42 R21.1 | U3.9 11.01,58.42
N$34
  Top 0.406: R24.1 7.89,57.43 7.36,57.43 6.74,58.05 6.74,58.79 7.25,59.3 8.54,59.3 R21.2 9.38,60.07 10.34,61.03 11.68,61.03 13.02,59.69 U3.8
N$35
  Top 0.406: R24.2 11.01,55.67 | R24.2 C9.1 11.64,53.34 U3.13 | R24.2 9.88,54.88 8.59,54.88 8.35,54.64 8.35,53.31 9.31,52.35 R27.1
N$36
  Top 0.406: R30.1 R27.2 | R27.2 11.14,52.07 U3.14 | R27.2 11.01,52.27 C9.2
N$37  (via drill 0.35)
  Top 0.406: R18.1 8,58.04 v7.62,58.42
  Bottom 0.406: VR6.P$2 6.98,59.05 v7.62,58.42
N$38
  Top 0.406: VR6.P$3 9.48,67.35 6.98,69.85 J6.3
N$39
  Top 0.406: 20.74,58.42 R17.2 | 20.74,58.42 R20.1 | U3.6 20.74,58.42
N$40
  Top 0.406: R23.1 23.86,57.43 24.39,57.43 25.01,58.05 25.01,58.79 24.5,59.3 23.21,59.3 R20.2 22.37,60.07 21.41,61.03 20.07,61.03 18.73,59.69 U3.7
N$41
  Top 0.406: R23.2 20.74,55.67 | R23.2 C8.1 20.11,53.34 U3.2 | R23.2 21.87,54.88 23.16,54.88 23.4,54.64 23.4,53.31 22.44,52.35 R26.1
N$42
  Top 0.406: R29.1 R26.2 | 20.61,52.07 R26.2 | U3.1 20.61,52.07 | 20.61,52.07 R26.2 | R26.2 20.74,52.27 C8.2
N$43  (via drill 0.35)
  Top 0.406: R17.1 23.75,58.04 v24.13,58.42
  Bottom 0.406: VR5.P$2 v24.13,58.42
N$44
  Top 0.406: J5.3 24.13,69.85 26.67,67.31 26.67,62.89 VR5.P$3
N$45
  Top 0.406: U5.7 77.22,28.52 R58.1
N$46
  Top 0.406: U5.5 73.03,26.59 C18.1 72.73,26.28 R54.2 73.92,23.96 73.92,18.61 72.65,17.34 49.97,17.34 V1.4
N$47
  Top 0.406: R46.1 84.77,7.3 Q1.3
N$48
  Top 0.406: R46.2 82.22,12.28 R47.1
  Bottom 0.406: R47.2 R47.1
N$49
  Top 0.406: R45.1 81.92,6.21 80.67,4.96 80.67,3.93 81.92,2.68 Q1.1
N$51
  Top 0.406: VR8.A1 24.31,6.52 25.65,7.87 R34.1
N$52
  Top 0.406: R44.2 84.61,37.66 94.24,28.02 94.24,18.03 92.97,16.76 | 92.97,16.76 92.96,16.76 | 92.97,16.76 92.96,16.76 | 92.96,16.76 85.73,9.53 85.73,7.9 85.71,7.88 85.71,5.07 Q1.2
N$53  (via drill 0.35)
  Top 0.406: U5.2 68.65,29.08 68.65,29.78 68.41,30.02 66.1,30.02 64.63,28.55 R59.2 62.25,28.55 v62.23,28.58
  Bottom 0.406: J11.3 92.08,15 98.42,21.34 98.42,24.71 93.22,29.9 86.74,29.9 85.59,31.05 84.59,31.05 83.44,29.9 63.55,29.9 v62.23,28.58
N$54
  Top 0.406: U5.1 66.29,28.52 R59.1
N$55
  Top 0.406: U5.3 70.48,26.59 C19.1 70.64,26.28 R55.2 67.95,23.59 66.32,23.59 65.54,24.38 53.84,24.38 V2.4
N$56
  Top 0.406: R35.1 28.96,8 26.31,5.35 VR8.B1
N$61  (via drill 0.35)
  Top 0.406: R32.2 30.99,21.46 v30.48,20.96 | 9.07,27.12 J8.3 10.34,27.12 10.79,26.67 10.79,4.45 10.04,3.68 J7.2
  Bottom 0.406: J7.2 13.21,3.68 v30.48,20.96
N$62  (via drill 0.35)
  Top 0.406: R31.2 23.62,21.08 v23.5,20.96
  Bottom 0.406: J7.3 14.67,18.3 14.67,19.55 15.38,20.26 22.8,20.26 v23.5,20.96
N$69
  Top 0.406: R51.1 24.77,34.44 U4.13 24.2,31.88 24.2,31.18 23.96,30.94 23.03,30.94 22.72,31.24 R53.2 C17.1
N$70
  Top 0.406: R53.1 C17.2 21.45,34.96 R57.2 23.5,33.82 U4.14
N$72
  Top 0.406: R50.1 29.85,34.44 U4.9 30.41,31.88 30.41,31.18 30.65,30.94 31.58,30.94 31.89,31.24 R52.2 C16.1
N$73
  Top 0.406: U4.8 31.12,33.67 R56.2 | R56.2 32.52,34.96 | R52.1 C16.2 33.16,34.96 R56.2
N$74
  Top 0.406: U4.1 23.5,26.89 R38.2 22.55,24.02 22.55,16.19 23.5,15.24 23.5,13.97 22.23,12.7 22.23,3.68 VR8.A2
  Bottom 0.406: VR8.A3 32.3,4.53 31.12,5.71 23.5,5.71 22.31,4.53 VR8.A2
N$75
  Top 0.406: U4.7 31.12,26.89 R39.2 31.94,23.9 31.94,16.02 31.34,15.42 31.34,15.38 30.31,14.35 VR8.B3 VR8.B2
N$78
  Top 0.406: 24.77,24.98 R34.2 | 24.77,24.98 R31.1 | U4.2 24.77,24.98
N$79
  Top 0.406: 29.85,24.98 R32.1 | 29.85,24.98 R35.2 | U4.6 29.85,24.98
OUTL
  Top 0.406: SV2.10 6.35,39.37 6.98,40 25.4,40 26.29,39.12 R49.2 R51.2
OUTR
  Top 0.406: 29.21,36.66 R50.2 | 29.21,36.66 R48.2 | 29.21,36.66 29.21,39.37 27.31,41.27 5.71,41.27 3.81,39.37 SV2.12
VDD
  Top 0.406: SV3.9 SV3.10 66.68,2.54 66.04,1.91 D7.A
VSS
  Top 0.406: SV3.2 SV3.1 58.23,8.7 61.3,8.7 D8.C
WET_L  (via drill 0.35)
  Top 0.406: v22.42,38.1 22.42,36.73 R57.1
  Bottom 0.406: v22.42,38.1 34.54,38.1 37.46,35.18 37.46,24.77 V1.3
WET_R
  Top 0.406: 32.51,36.66 R56.1 37.74,36.66 48.51,25.89 V2.3

### Text on the board
bPlace: designed & assembled in / tainan, taiwan. 2017 | Red / Stripe!